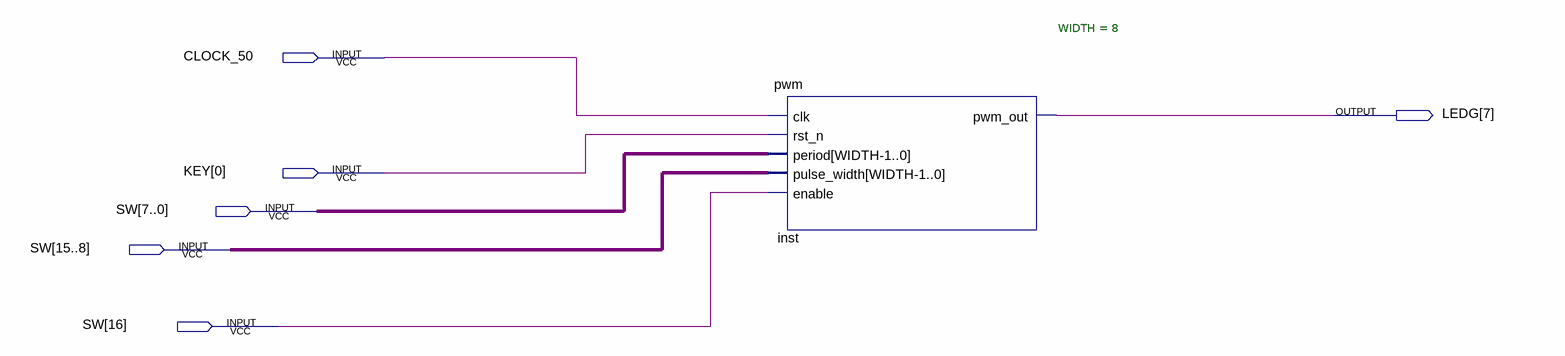
[diagram p0: schematic sheet]
// Quartus schematic PWM_Gold_Team.bdf as structural Verilog: 1 symbols, 6 pins
module PWM_Gold_Team (
  input  CLOCK_50,
  input  [0:0] KEY,
  input  [16:0] SW,
  output [7:7] LEDG
);

  pwm #(.WIDTH(8)) inst (
    .clk(CLOCK_50), .rst_n(KEY[0]), .period(SW[7:0]), .pulse_width(SW[15:8]), .enable(SW[16]),
    .pwm_out(LEDG[7]));
endmodule
